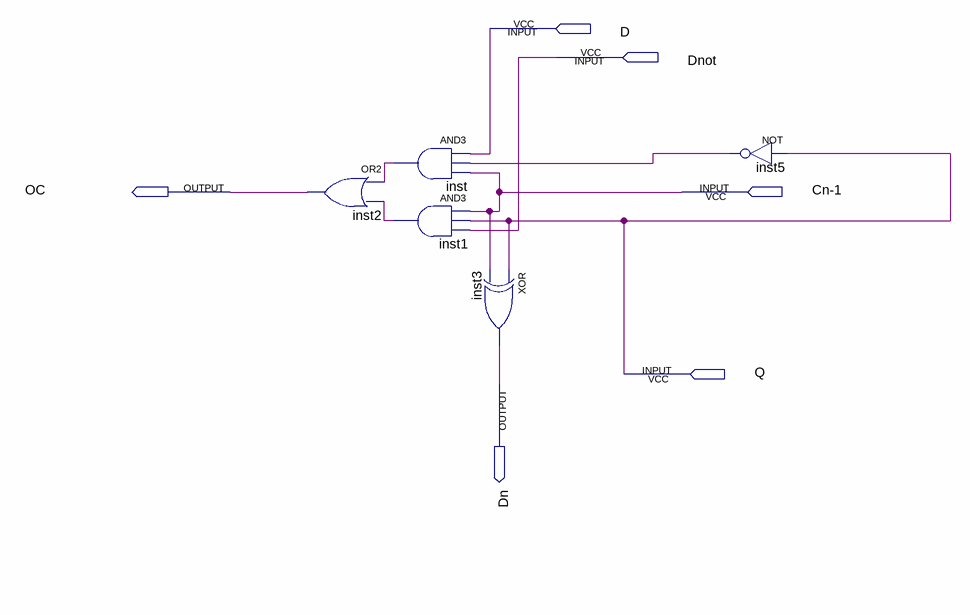
[diagram p0: schematic sheet]
// Quartus schematic HAS.bdf as structural Verilog: 5 symbols, 6 pins
module HAS (
  input  D,
  input  Dnot,
  input  \Cn-1 ,
  input  Q,
  output OC,
  output Dn
);

  wire inst1_out, inst5_out, inst_out;

  or inst2 (OC, inst_out, inst1_out);
  and inst (inst_out, D, inst5_out, \Cn-1 );
  and inst1 (inst1_out, \Cn-1 , Q, Dnot);
  xor inst3 (Dn, Q, \Cn-1 );
  not inst5 (inst5_out, Q);
endmodule
